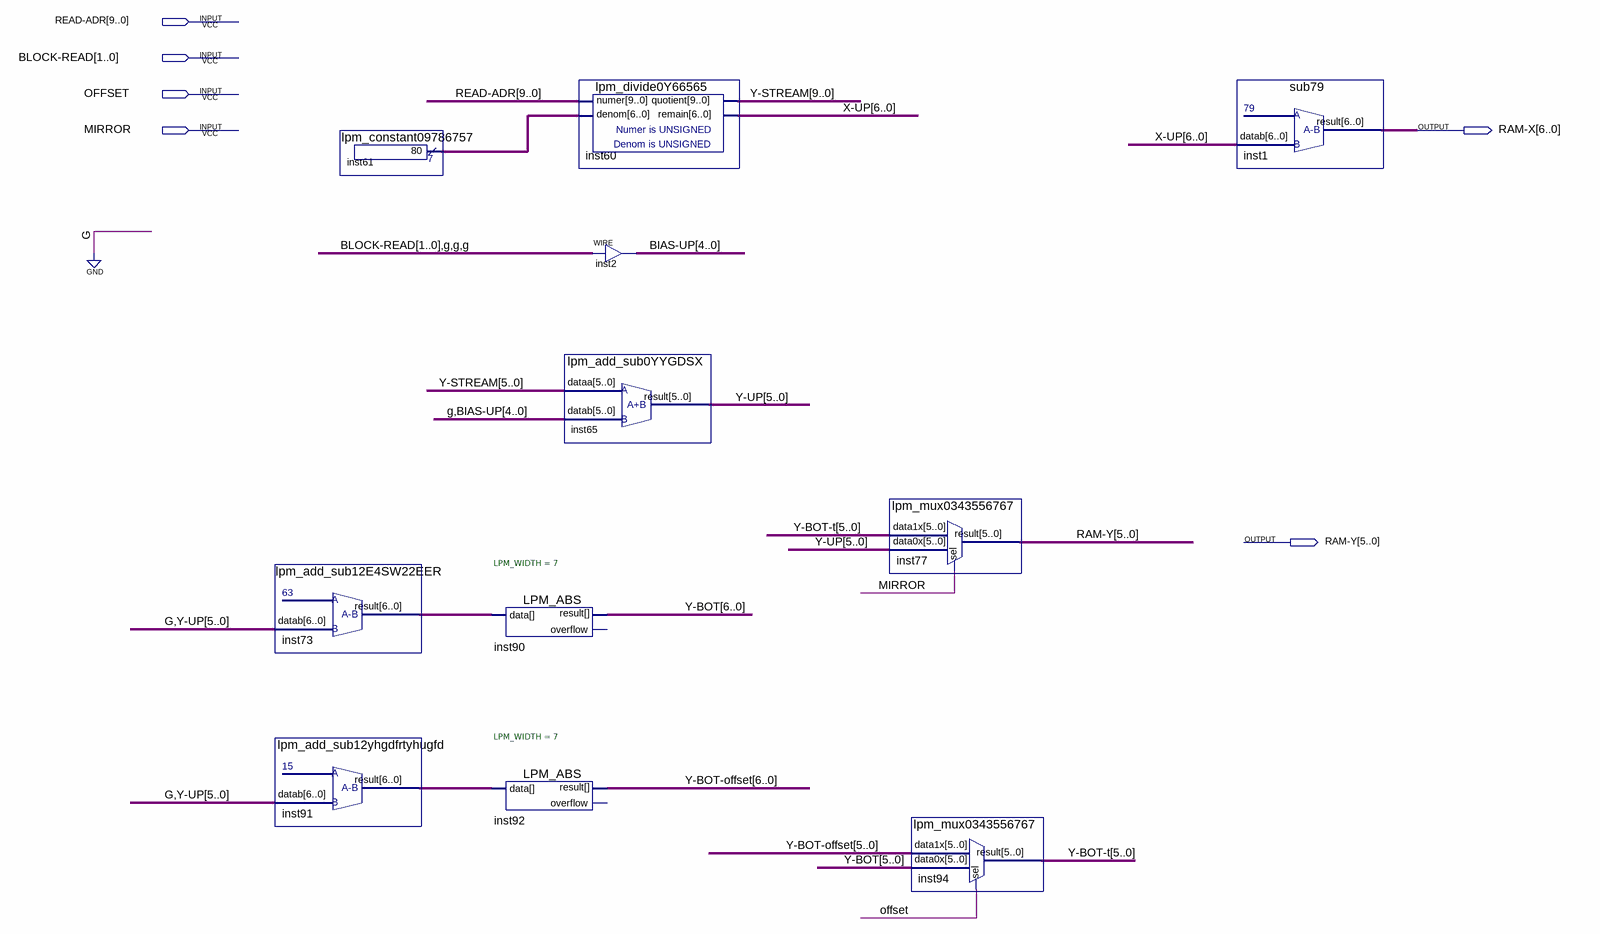
[diagram p0: schematic sheet]
// Quartus schematic ADRESS-HTPA-RAM.bdf as structural Verilog: 11 symbols, 6 pins
module \ADRESS-HTPA-RAM  (
  input  [9:0] \READ-ADR ,
  input  [1:0] \BLOCK-READ ,
  input  OFFSET,
  input  MIRROR,
  output [6:0] \RAM-X ,
  output [5:0] \RAM-Y 
);

  wire [4:0] \BIAS-UP ;
  wire [5:0] \Y-BOT-t , \Y-UP ;
  wire [6:0] inst61_result, inst73_result, inst91_result, \X-UP , \Y-BOT , \Y-BOT-offset ;
  wire [9:0] \Y-STREAM ;

  lpm_add_sub12E4SW22EER inst73 (.datab({1'b0, \Y-UP }), .result(inst73_result));
  lpm_add_sub12yhgdfrtyhugfd inst91 (.datab({1'b0, \Y-UP }), .result(inst91_result));
  lpm_constant09786757 inst61 (.result(inst61_result));
  LPM_ABS #(.LPM_WIDTH(7)) inst90 (.data(inst73_result), .result(\Y-BOT ));  // open: overflow
  LPM_ABS #(.LPM_WIDTH(7)) inst92 (.data(inst91_result), .result(\Y-BOT-offset ));  // open: overflow
  lpm_add_sub0YYGDSX inst65 (.dataa(\Y-STREAM [5:0]), .datab({1'b0, \BIAS-UP }), .result(\Y-UP ));
  lpm_divide0Y66565 inst60 (.numer(\READ-ADR ), .denom(inst61_result), .quotient(\Y-STREAM ), .remain(\X-UP ));
  assign \BIAS-UP  = {\BLOCK-READ , 3'b000};  // WIRE inst2
  lpm_mux0343556767 inst77 (.data1x(\Y-BOT-t ), .data0x(\Y-UP ), .sel(MIRROR), .result(\RAM-Y ));
  lpm_mux0343556767 inst94 (.data1x(\Y-BOT-offset [5:0]), .data0x(\Y-BOT [5:0]), .sel(OFFSET), .result(\Y-BOT-t ));
  sub79 inst1 (.datab(\X-UP ), .result(\RAM-X ));
endmodule
